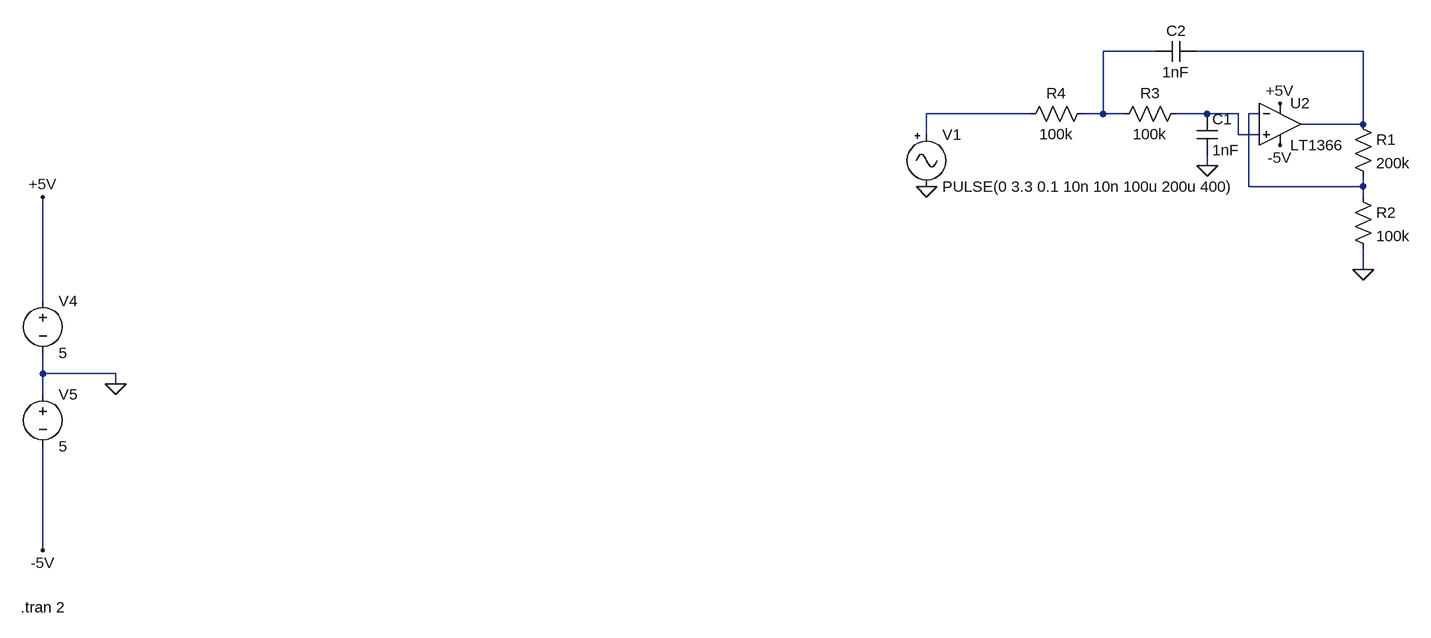
[diagram p0: schematic OPamp_circuit_v0.asc]
OPamp_circuit_v0.asc, the LTspice schematic file:
Version 4
SHEET 1 1632 712
WIRE 1232 -160 1152 -160
WIRE 1552 -160 1296 -160
WIRE 1040 -64 880 -64
WIRE 1152 -64 1152 -160
WIRE 1152 -64 1120 -64
WIRE 1184 -64 1152 -64
WIRE 1312 -64 1264 -64
WIRE 1360 -64 1312 -64
WIRE 1392 -64 1376 -64
WIRE 1552 -48 1552 -160
WIRE 1552 -48 1456 -48
WIRE 880 -32 880 -64
WIRE 1360 -32 1360 -64
WIRE 1392 -32 1360 -32
WIRE 1312 16 1312 0
WIRE 1376 48 1376 -64
WIRE 1552 48 1552 32
WIRE 1552 48 1376 48
WIRE 1552 64 1552 48
WIRE 1552 176 1552 144
WIRE -480 224 -480 64
WIRE -480 336 -480 304
WIRE -368 336 -480 336
WIRE -368 352 -368 336
WIRE -480 368 -480 336
WIRE -480 608 -480 448
FLAG -368 352 0
FLAG -480 64 +5V
FLAG -480 608 -5V
FLAG 1312 16 0
FLAG 1552 176 0
FLAG 1424 -80 +5V
FLAG 1424 -16 -5V
FLAG 880 48 0
SYMBOL Opamps\\LT1366 1424 -112 R0
SYMATTR InstName U2
SYMBOL Misc\\signal 880 -48 R0
WINDOW 123 0 0 Left 0
WINDOW 39 0 0 Left 0
SYMATTR InstName V1
SYMATTR Value PULSE(0 3.3 0.1 10n 10n 100u 200u 400)
SYMBOL voltage -480 208 R0
WINDOW 123 0 0 Left 0
WINDOW 39 0 0 Left 0
SYMATTR InstName V4
SYMATTR Value 5
SYMBOL voltage -480 352 R0
WINDOW 123 0 0 Left 0
WINDOW 39 0 0 Left 0
SYMATTR InstName V5
SYMATTR Value 5
SYMBOL res 1536 -64 R0
SYMATTR InstName R1
SYMATTR Value 200k
SYMBOL res 1536 48 R0
SYMATTR InstName R2
SYMATTR Value 100k
SYMBOL cap 1296 -64 R0
SYMATTR InstName C1
SYMATTR Value 1nF
SYMBOL cap 1296 -176 R90
WINDOW 0 0 32 VBottom 2
WINDOW 3 32 32 VTop 2
SYMATTR InstName C2
SYMATTR Value 1nF
SYMBOL res 1280 -80 R90
WINDOW 0 0 56 VBottom 2
WINDOW 3 32 56 VTop 2
SYMATTR InstName R3
SYMATTR Value 100k
SYMBOL res 1136 -80 R90
WINDOW 0 0 56 VBottom 2
WINDOW 3 32 56 VTop 2
SYMATTR InstName R4
SYMATTR Value 100k
TEXT -514 696 Left 2 !.tran 2

The netlist it stands for:
* OPamp_circuit_v0.asc
XU2 N004 N005 +5V -5V N002 LT1366  ; pins In+ In- V+ V- OUT
V1 N003 0 PULSE(0 3.3 0.1 10n 10n 100u 200u 400)
V4 +5V 0 5
V5 0 -5V 5
R1 N002 N005 200k
R2 N005 0 100k
C1 N004 0 1nF
C2 N002 N001 1nF
R3 N004 N001 100k
R4 N001 N003 100k
.tran 2
.lib LTC.lib
.backanno
.end